# Altium schematic sheet SymphonyLights_SOC v1.2.SchDoc
size A4
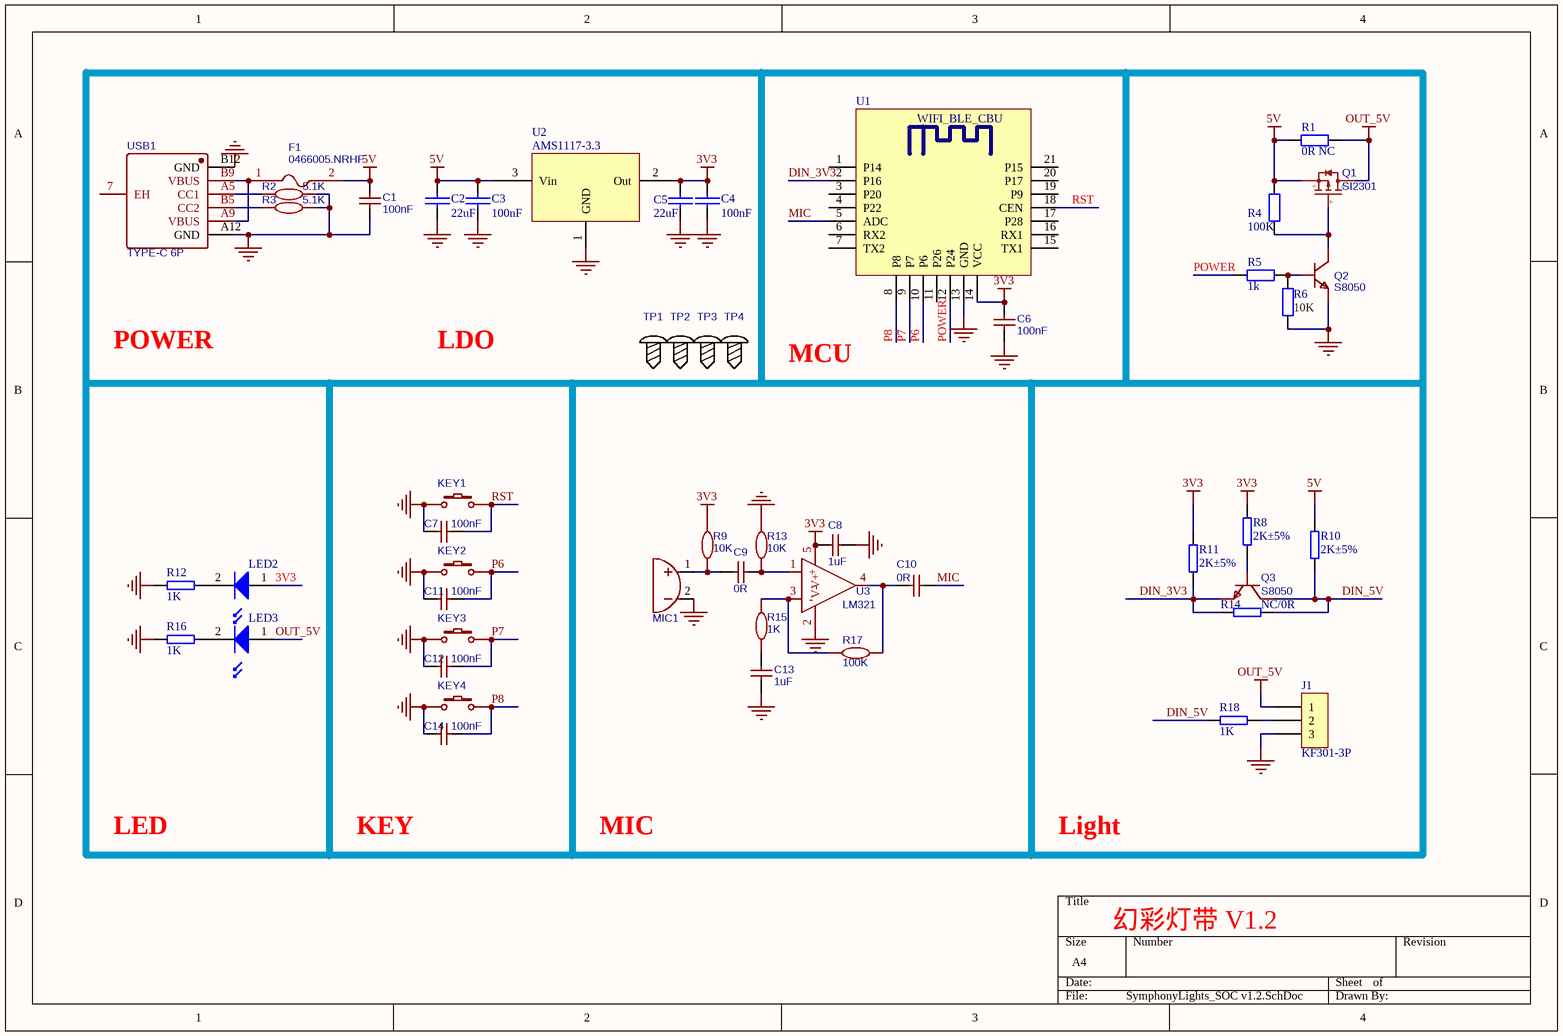
[diagram p0: SymphonyLights_SOC v1.2.SchDoc]

## Parts
C1  100nF  [0805C]
C2  22uF  [0805C]
C3  100nF  [0805C]
C4  100nF  [0805C]
C5  22uF  [0805C]
C6  100nF  [0805C]
C7  100nF  [0805C]
C8  1uF  [0805C]
C9  0R  [0805C]
C10  0R  [0805C]
C11  100nF  [0805C]
C12  100nF  [0805C]
C13  1uF  [0805C]
C14  100nF  [0805C]
F1  0466005.NRHF  [1206F]
J1  KF301-3P  [SIP3 - 2.54]
KEY1  RESET  [KEY-SMD_4P-L7.8-W2.8-P4.20-EH]  (value not drawn)
KEY2  场景  [KEY-SMD_4P-L7.8-W2.8-P4.20-EH]  (value not drawn)
KEY3  音乐  [KEY-SMD_4P-L7.8-W2.8-P4.20-EH]  (value not drawn)
KEY4  开关  [KEY-SMD_4P-L7.8-W2.8-P4.20-EH]  (value not drawn)
LED2  LED  [0805LED]  (value not drawn)
LED3  LED  [0805LED]  (value not drawn)
MIC1  GMI6050P-66DB  [MIC-TH_BD6.0-P1.90-D0.4-L-RD]  (value not drawn)
Q1  SI2301  [SOT-23(SOT-23-3)]
Q2  S8050  [SOT-23(SOT-23-3)]
Q3  S8050  [SOT-23(SOT-23-3)]
R1  0R NC  [0805R]
R2  5.1K  [0805R]
R3  5.1K  [0805R]
R4  100K  [0805R]
R5  1k  [0805R]
R6  10K  [0805R]
R8  2K±5%  [0805R]
R9  10K  [0805R]
R10  2K±5%  [0805R]
R11  2K±5%  [0805R]
R12  1K  [0805R]
R13  10K  [0805R]
R14  NC/0R  [0805R]
R15  1K  [0805R]
R16  1K  [0805R]
R17  100K  [0805R]
R18  1K  [0805R]
TP1  (no value)  [M3螺丝孔]
TP2  (no value)  [M3螺丝孔]
TP3  (no value)  [M3螺丝孔]
TP4  (no value)  [M3螺丝孔]
U1  WIFI_BLE_CBU  [WIFI_BLE_CBU]  (value not drawn)
U2  AMS1117-3.3  [SOT-223]
U3  LM321  [SOT-23-5]
USB1  TYPE-C 6P  [TYPE-C-SMD_TYPE-C-6P]

## Nets
3V3: C4.1 C5.1 C6.2 C8.1 LED2.1 R8.1 R9.1 R11.1 U1.14(VCC) U2.2(Out) U3.5(V+)
5V: C1.2 C2.1 C3.1 F1.2 Q1.2(S) R1.1 R4.2 R10.1 U2.3(Vin)
GND: C1.1 C2.2 C3.2 C4.2 C5.2 C6.1 C7.1 C8.2 C11.1 C12.1 C13.2 C14.1 J1.3 KEY1.2 KEY2.2 KEY3.2 KEY4.2 MIC1.2 Q2.2(E) R2.2 R3.2 R6.2 R12.2 R13.1 R16.2 U1.13(GND) U2.1(GND) U3.2(V-) USB1.A12(GND) USB1.B12(GND)
OUT_5V: J1.1 LED3.1 Q1.3(D) R1.2
DIN_3V3: Q3.2(E) R11.2 R14.1 U1.2(P16)
DIN_5V: Q3.3(C) R10.2 R14.2 R18.1
MIC: C10.1 U1.5(ADC)
P6: C11.2 KEY2.1 U1.10(P6)
P7: C12.2 KEY3.1 U1.9(P7)
P8: C14.2 KEY4.1 U1.8(P8)
POWER: R5.1 U1.12(P24)
RST: C7.2 KEY1.1 U1.18(CEN)
NetC9_1: C9.1 R13.2 U3.1(+)
NetC9_2: C9.2 MIC1.1 R9.2
NetC10_2: C10.2 R17.2 U3.4
NetC13_1: C13.1 R15.1
NetF1_1: F1.1 USB1.A9(VBUS) USB1.B9(VBUS)
NetJ1_2: J1.2 R18.2
NetLED2_2: LED2.2 R12.1
NetLED3_2: LED3.2 R16.1
NetQ1_1: Q1.1(G) Q2.3(C) R4.1
NetQ2_1: Q2.1(B) R5.2 R6.1
NetQ3_1: Q3.1(B) R8.2
NetR2_1: R2.1 USB1.A5(CC1)
NetR3_1: R3.1 USB1.B5(CC2)
NetR15_2: R15.2 R17.1 U3.3(-)

Not connected (* = marked no-connect by the designer): U1 1(P14) 3(P20) 4(P22) 6(RX2) 7(TX2) 11(P26) 15(TX1) 16(RX1) 17(P28) 19(P9) 20(P17) 21(P15); USB1 7(EH)

## Notes on the sheet
- POWER
- LDO
- MCU
- LED
- KEY
- MIC
- Light
- 幻彩灯带 V1.2

## Library data of the parts
C1 C6-C14 = 100nF: BOM_Manufacturer: FH; BOM_Manufacturer Part: 0805B104K500NT; nameAlias: Capacitance; BOM_Supplier: LCSC; BOM_Supplier Part: C38141; spicePre: C; spiceSymbolName: 0805B104K500NT
C2-C5 = CAP: Capacitor
F1 = 0466005.NRHF: BOM_Manufacturer: Littelfuse; BOM_Supplier: LCSC; BOM_Manufacturer Part: 0466005.NRHF; BOM_Supplier Part: C57525; spicePre: F; spiceSymbolName: 0466005.NRHF
J1 = CON3: Connector
KEY1-KEY4 = (no symbol name): BOM_Manufacturer Part: K2-1107ST-A4SW-06; Contributor: LCEDA_Lib; BOM_Supplier Part: C118141; BOM_Supplier: LCSC; spicePre: K
MIC1 = GMI6050P-66DB: BOM_Manufacturer: INGHAi; Contributor: LCSC; BOM_Supplier: LCSC; BOM_Supplier Part: C233954; BOM_Manufacturer Part: GMI6050P-66DB; spicePre: M; spiceSymbolName: GMI6050P-66DB
Q1 = SI2301: BOM_Manufacturer: Hottech; Contributor: lengyuefeng; SMT Type: Extend; BOM_Supplier: LCSC; BOM_Manufacturer Part: SI2301; BOM_Supplier Part: C181086; BOM_LCSC Assembly: Yes; spicePre: Q; spiceSymbolName: SI2301
Q2 Q3 = S8050: BOM_Manufacturer: CJ; SMT Type: Basic; BOM_Supplier: LCSC; BOM_Manufacturer Part: S8050; image: //image.lceda.cn/szlcsc/C2146.jpg; BOM_Supplier Part: C2146; BOM_LCSC Assembly: Yes; spicePre: Q; spiceSymbolName: S8050
R1 R4-R6 = Res2: Resistor; Published: 8-Jun-2000; LatestRevisionDate: 17-Jul-2002; LatestRevisionNote: Re-released for DXP Platform.; Publisher: Altium Limited
R2 R3 R9 R13 R15 R17 = 10K: BOM_Manufacturer: ResistorToday; BOM_Manufacturer Part: AECR0402F10K0K9; nameAlias: Resistance (Ohms); Contributor: LCSC; Package Display: No; BOM_Supplier: LCSC; BOM_Supplier Part: C328298; spicePre: R; spiceSymbolName: AECR0402F10K0K9
R8 R10-R12 R14 R16 R18 = RES5
TP1-TP4 = (no symbol name): Contributor: 455553Z; spicePre: T
U1 = WIFI_BLE_CBU: Module
U2 = GM1117
U3 = LM321: Contributor: KiCAD; license: https://www.gnu.org/licenses/lgpl-2.1.html; spicePre: U; spiceSymbolName: LM321
USB1 = TYPE-C 6P(073): BOM_Manufacturer: SHOU HAN; Contributor: LCSC; BOM_Supplier: LCSC; BOM_Supplier Part: C668623; BOM_Manufacturer Part: TYPE-C 6P(073); spicePre: U; spiceSymbolName: TYPE-C 6P(073)
LED2 LED3 = LED: Published: *; LatestRevisionDate: *; LatestRevisionNote: *; DatasheetDocument: *; PackageDocument: *; PackageReference: *; Publisher: *; ComponentLink1Description: *; ComponentLink1URL: *; Code_JEDEC: *